# Altium schematic sheet INDEX.SchDoc
size 420 x 297 mm; SheetNumber: 1; SheetTotal: 4
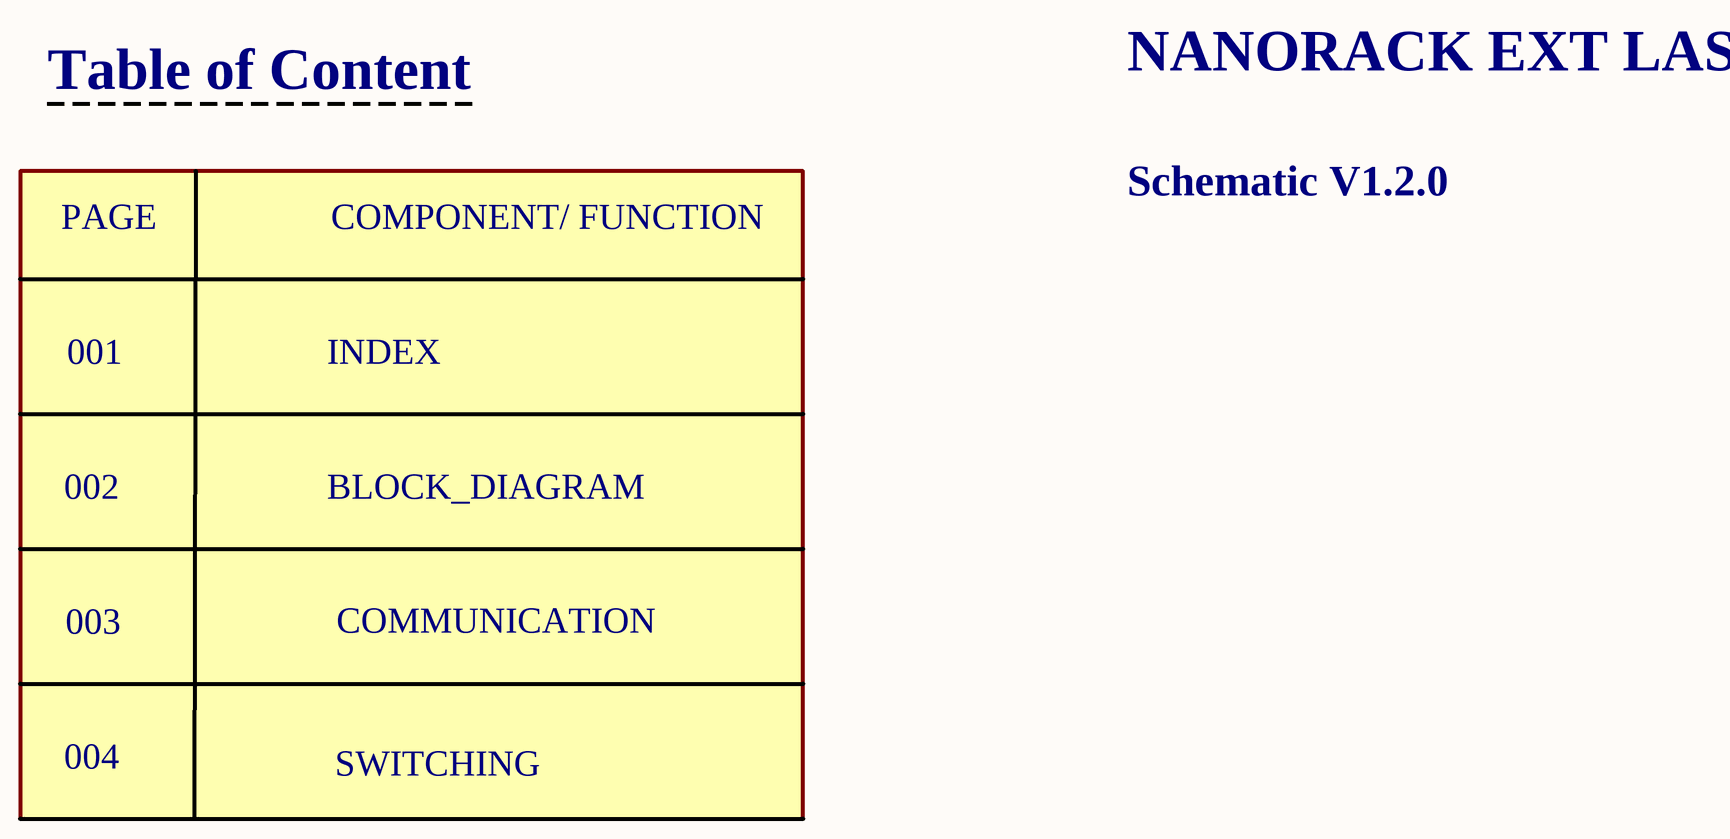
[diagram p0: INDEX.SchDoc]

## Notes on the sheet
- Table of Content
- NANORACK EXT LASER
- PAGE
- COMPONENT/ FUNCTION
- Schematic V1.2.0
- 001
- INDEX
- 002
- BLOCK_DIAGRAM
- 003
- COMMUNICATION
- 004
- SWITCHING
- Project:
- BEE-PC1
- Sub-system:
- Design by:
- Hung Nguyen D.
- Bao Bui Q.
- Sheet title:
- Sheet
- A3
- of
- Checked by:
- Approved by:
- Vu Pham
- Revision:
- Document No:
- V1.2.0
- Size:
- Date: